# Altium schematic sheet IN-14 VALVE CATHODE DRIVER.SchDoc
size A4; SheetNumber: 7; SheetTotal: 9
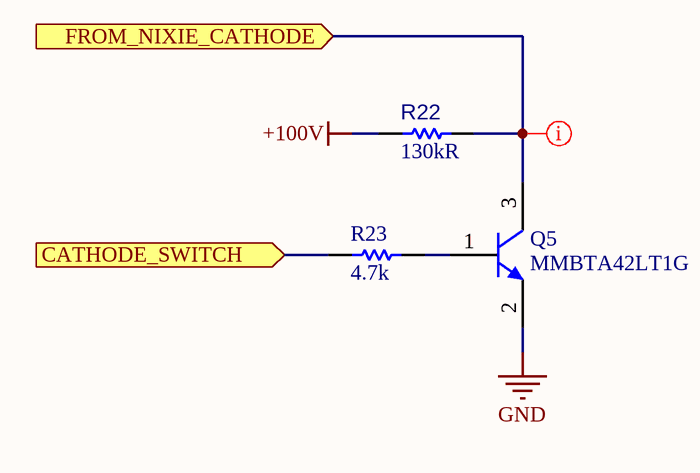
[diagram p0: IN-14 VALVE CATHODE DRIVER.SchDoc]

## Parts
?  (no value)
Q5  MMBTA42LT1G  [ONSC-SOT-23-3-318-08_V]
R22  value 130kR  [RESC3126X65X50NL10T20]  (hidden comment: ERJP14F1303U)
R23  value 4.7k  [RESC1608X55X25NL10T15]  (hidden comment: Resistor 4k7 +/-1% 0603 100 mW)

## Ports
CATHODE_SWITCH (in), FROM_NIXIE_CATHODE (in)

## Nets
+100V: R22.2
GND: Q5.2(E)
CATHODE_SWITCH: R23.1 ; port CATHODE_SWITCH
FROM_NIXIE_CATHODE: Q5.3(C) R22.1 ; port FROM_NIXIE_CATHODE
NetQ5_1: Q5.1(B) R23.2

## Layout directives
net class HIGH VOLTAGE 100V: FROM_NIXIE_CATHODE

## Notes on the sheet
- Project:
- Designer:
- Sheet
- of
- Filename:

## Library data of the parts
? = CMP-00003-4: The KETS Schematic Sheet Title Block
Q5 = CMP-013-00062-1: Bipolar (BJT) Single Transistor, General Purpose, NPN, 300 V, 500 mA, 225 mW, SOT-23, Surface Mount; Manufacturer Lifecycle Status: ACTIVE; Frequency: 50MHz; Max Collector Current: 500mA; Collector Emitter Breakdown Voltage: 300V; Emitter Base Voltage (VEBO): 6V; Collector Emitter Saturation Voltage: 500mV; Number of Elements: 1; Max Power Dissipation: 300mW; hFE Min: 40; Clock Frequency: 50MHz; Element Configuration: Single; Packaging: Tape and Reel; Lead Free: Lead Free; RoHS: Compliant; Number of Terminals: 3; Lifecycle Status: Production; Current Rating: 500mA; Polarity: NPN; Width: 1.397mm; Case/Package: SOT-23-3; Max Operating Temperature: 150°C; China RoHS: Compliant; Height: 1.016mm; Weight: 4.535924g; Gain Bandwidth Product: 50MHz; Contact Plating: Tin; Schedule B: 8541210080, 8541210080; Pins: 3; Transition Frequency: 50MHz; Voltage Rating (DC): 300V; REACH SVHC: Yes; Collector Emitter Voltage (VCEO): 300V; Min Operating Temperature: -55°C; Collector Base Voltage (VCBO): 300V; Length: 3.0226mm; Max Breakdown Voltage: 300V; Radiation Hardening: No
R22 = CMP-00392-1: Res Thick Film 1210 130K Ohm 1% 0.5W ±100ppm/°C Molded SMD Embossed Carrier T/R; Manufacturer Lifecycle Status: ACTIVE; Part Series: Anti-Surge High Power Thick Film Chip Resistors; Power Rating: 500mW; Working Voltage: 200V; Min Operating Temperature: -55°C; Case Code (Imperial): 1210; REACH SVHC: Yes; Number of Terminals: 2; Case/Package: 1210; Packaging: Cut Tape; Width: 2.5mm; Composition: Thick Film; Tolerance: 1%; Power: 500mW; Lifecycle Status: Production; Voltage Rating: 200V; Power Dissipation: 500mW; Mounting Technology: Surface Mount; Height: 600µm; Max Operating Temperature: 155°C; RoHS: Compliant; Case Code (Metric): 3225; Length: 3.2mm; Depth: 2.5mm; Voltage Rating (DC): 200V; Termination: Flat; Pins: 2; Temperature Coefficient: 100ppm/°C; Contact Plating: Tin
R23 = CMP-009-00031-13: Chip Resistor, 4.7 KOhm, +/- 1%, 0.1 W, -55 to 155 degC, 0603 (1608 Metric); Power: 100mW; RoHS Compliant: True; Min Operating Temperature: -55°C; Tolerance: 1%; Mounting Technology: SM; Max Operating Temperature: 155°C; Pins: 2; Case/Package: 0603